# Altium schematic sheet power.SchDoc
size Tabloid
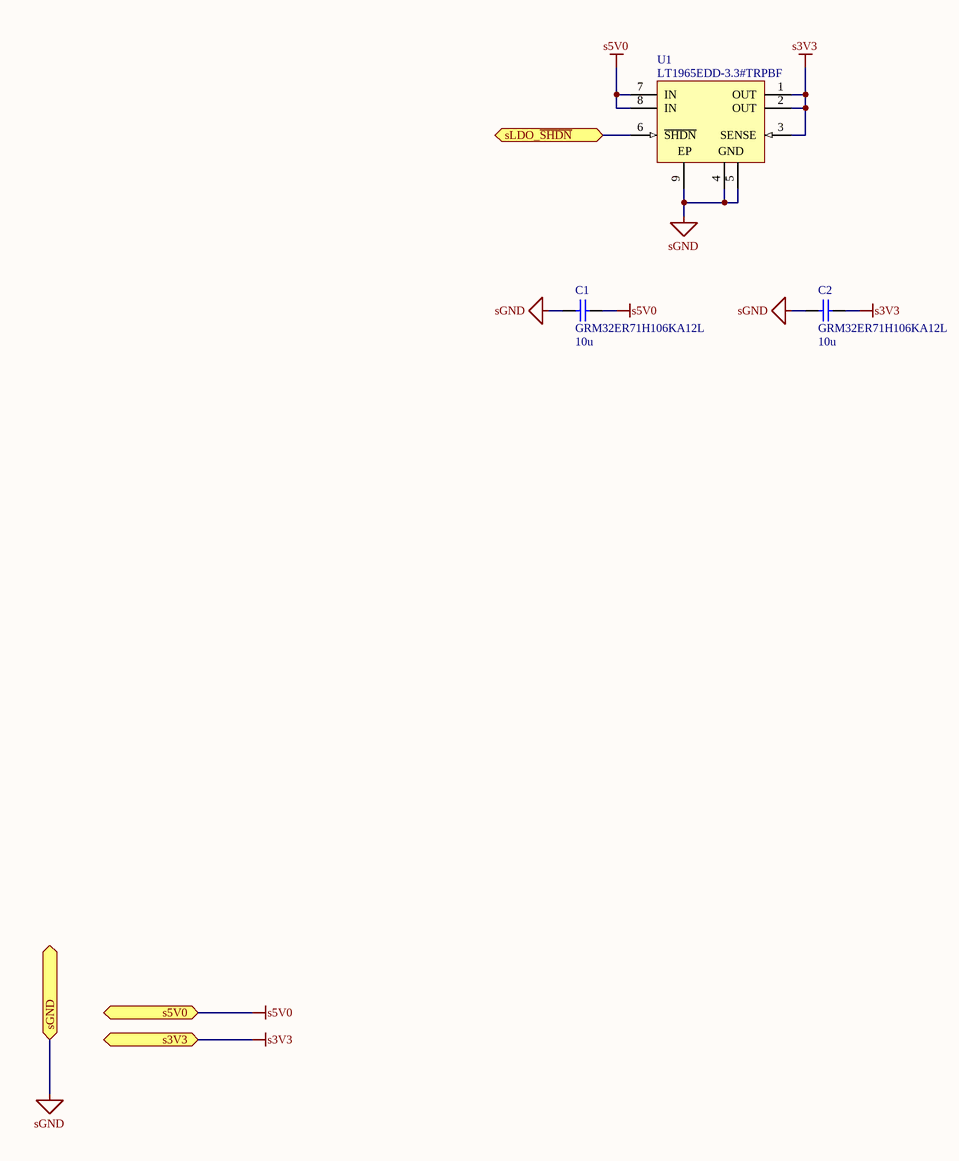
[diagram p0: power.SchDoc]

## Parts
C1  GRM32ER71H106KA12L  value 10u  [1210]
C2  GRM32ER71H106KA12L  value 10u  [1210]
U1  LT1965EDD-3.3#TRPBF  [LT-DD-8_V]

## Ports
s3V3, s5V0, sGND, sLDO_~{SHDN}

## Nets
s3V3: C2.2 U1.1(OUT) U1.2(OUT) U1.3(SENSE) ; port s3V3
s5V0: C1.2 U1.7(IN) U1.8(IN) ; port s5V0
sGND: C1.1 C2.1 U1.4(GND) U1.5(GND) U1.9(EP) ; port sGND
sLDO_~{SHDN}: U1.6(~{SHDN}) ; port sLDO_~{SHDN}

## Library data of the parts
C1 C2 = GRM32ER71HxxxKdddd: -55-125C, 1005, 50V, X7R, ±10%
U1 = CMP-0476-00225-1: 1.1 A, Low Noise, Low Dropout Linear Regulator, 1.8 to 20 V Vin, 3.3 V Vout, 8-pin SON (DD-8), -40 to 125 degC, Pb-Free, Tape and Reel; Manufacturer: Linear Technology; Number of Outputs: 1; Iout(mA): 1100; Noise(uV): 40; Dropout Voltage(V): 0.31; Discrete Pass Element: no; Vin Max(V): 20; Output Voltage: 3.3 V; PSRR(dB): 75; Isupply(mA): 0.5; Vin Min(V): 1.8; PackageReference: DD-8; PackageDescription: 8-Pin Plastic DFN, Body 3 x 3 mm, Pitch 0.5 mm; Code_JEDEC: MO-229; ComponentLink2URL: http://cds.linear.com/docs/en/datasheet/1965fa.pdf; PackageVersion: Jun-10; ComponentLink3URL: http://cds.linear.com/docs/en/packaging/DFN_8_05-08-1698.pdf; ComponentLink2Description: Datasheet; Packing: Tape and Reel; Shutdown Current(uA): 1; PartNumber: LT1965EDD-3.3#TRPBF; ComponentLink1URL: http://www.linear.com/; RoHS: TRUE; Mounting Technology: Surface Mount; ComponentLink3Description: Package Specification; ComponentLink1Description: Manufacturer URL; DatasheetVersion: Rev. A